# EAGLE design PRG_1_0 (EAGLE 8.3.2)
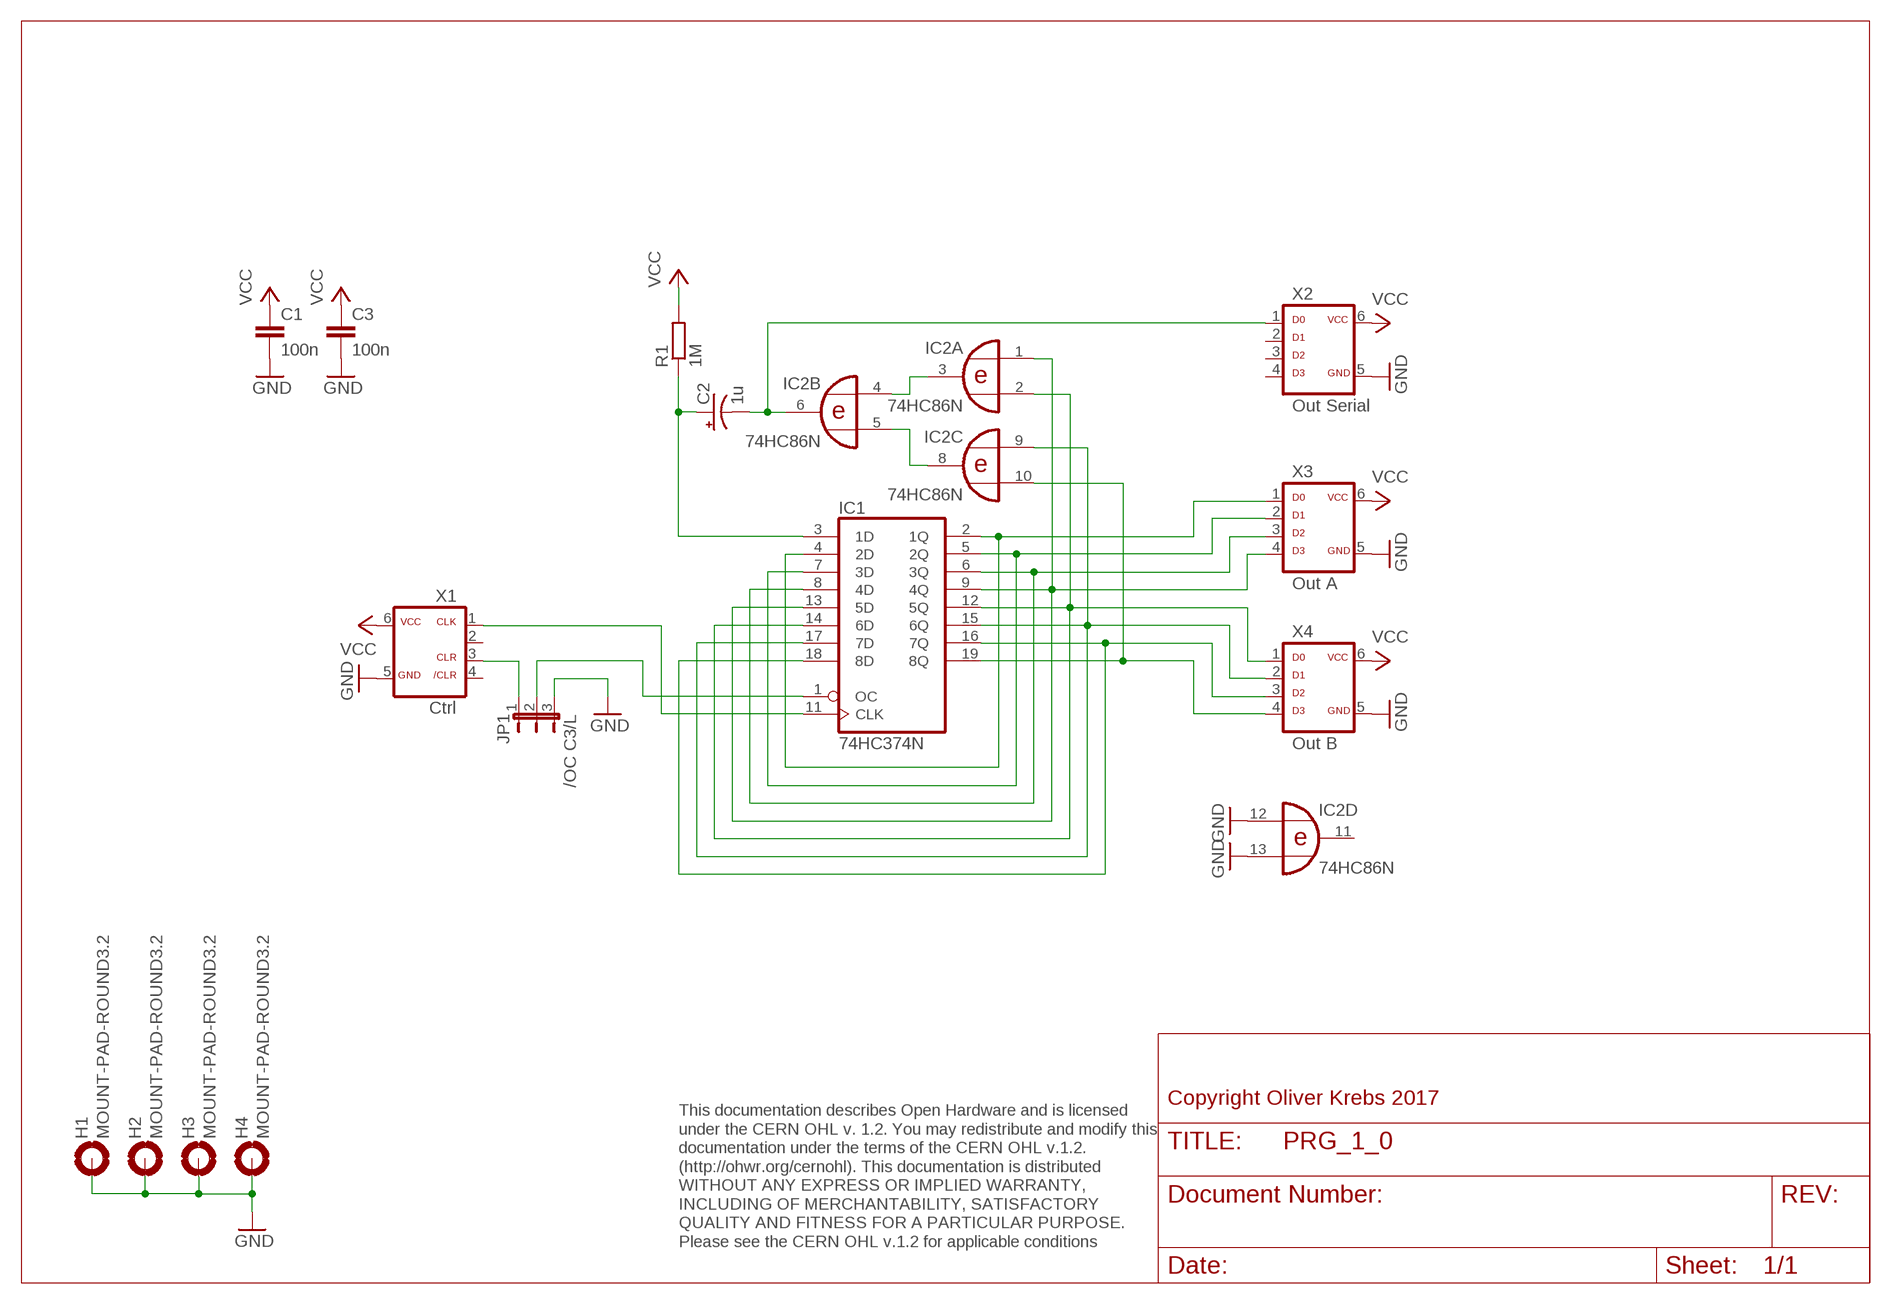
[diagram p0: schematic, sheet 1]

## Parts
C1  100n  C-EU050-025X075  [C050-025X075]
C2  1u  CAP_POLPTH2  [CPOL-RADIAL-10UF-25V]
C3  100n  C-EU050-025X075  [C050-025X075]
H1  MOUNT-PAD-ROUND3.2  [3,2-PAD]
H2  MOUNT-PAD-ROUND3.2  [3,2-PAD]
H3  MOUNT-PAD-ROUND3.2  [3,2-PAD]
H4  MOUNT-PAD-ROUND3.2  [3,2-PAD]
IC1  74HC374N  [DIL20]
IC2  74HC86N  [DIL14]
JP1  /OC C3/L  JP2EJP2-U  [JP2-U]
R1  1M  R-EU_0207/10  [0207/10]
X1  Ctrl  ML6C  [ML-6]
X2  Out Serial  ML6D  [ML-6]
X3  Out A  ML6D  [ML-6]
X4  Out B  ML6D  [ML-6]

## Nets
GND: C1.2 C3.2 H1.B3,2(MOUNT) H2.B3,2(MOUNT) H3.B3,2(MOUNT) H4.B3,2(MOUNT) IC2.12(D:I0) IC2.13(D:I1) JP1.3 X1.5 X2.5 X3.5 X4.5
N$1: IC2.3(A:O) IC2.4(B:I0)
N$2: IC2.5(B:I1) IC2.8(C:O)
N$3: C2.2(-) IC2.6(B:O) X2.1
N$4: C2.1(+) IC1.3(1D) R1.1
N$9: IC1.11(CLK) X1.1
N$10: IC1.1(OC) JP1.2
N$11: IC1.2(1Q) IC1.4(2D) X3.1
N$12: IC1.5(2Q) IC1.7(3D) X3.2
N$13: IC1.6(3Q) IC1.8(4D) X3.3
N$14: IC1.9(4Q) IC1.13(5D) IC2.1(A:I0) X3.4
N$15: IC1.12(5Q) IC1.14(6D) IC2.2(A:I1) X4.1
N$16: IC1.15(6Q) IC1.17(7D) IC2.9(C:I0) X4.2
N$17: IC1.16(7Q) IC1.18(8D) X4.3
N$18: IC1.19(8Q) IC2.10(C:I1) X4.4
N$19: JP1.1 X1.3
VCC: C1.1 C3.1 R1.2 X1.6 X2.6 X3.6 X4.6
Unconnected: IC2.11(D:O) X1.2 X1.4 X2.2 X2.3 X2.4

## Notes on the sheet
- Copyright Oliver Krebs 2017
- This documentation describes Open Hardware and is licensed 
  under the CERN OHL v. 1.2. You may redistribute and modify this 
  documentation under the terms of the CERN OHL v.1.2. 
  (http://ohwr.org/cernohl). This documentation is distributed
  WITHOUT ANY EXPRESS OR IMPLIED WARRANTY, 
  INCLUDING OF MERCHANTABILITY, SATISFACTORY 
  QUALITY AND FITNESS FOR A PARTICULAR PURPOSE. 
  Please see the CERN OHL v.1.2 for applicable conditions

## Power pins joined to a net without a drawn wire
GND: IC1.10(GND) IC2.7(P:GND)
VCC: IC1.20(VCC) IC2.14(P:VCC)

## Library data of the parts
C1 C3 = 01-my_rcl:C-EU: CAPACITOR, European symbol
C2 = SparkFun-Passives:CAP_POL: Capacitor Polarized These are standard SMD and PTH capacitors. Normally 10uF, 47uF, and 100uF in electrolytic and tantalum varieties. Always verify the external diameter of the through hole cap, it varies with capacity, voltage, and manufacturer. The EIA devices should be standard.
H1-H4 = holes:MOUNT-PAD-ROUND: MOUNTING PAD, round
IC1 = 74xx-eu:74*374: Octal D type transparent LATCH, edge triggered
IC2 = 74xx-eu:74*86: Quad 2-input EXCLUSIVE-OR (XOR) gate
JP1 = 01-my-jumper:JP2E: JUMPER
R1 = 01-my_rcl:R-EU_: RESISTOR, European symbol
X1 = 01-my-con:ML6C
X2-X4 = 01-my-con:ML6D

## Board
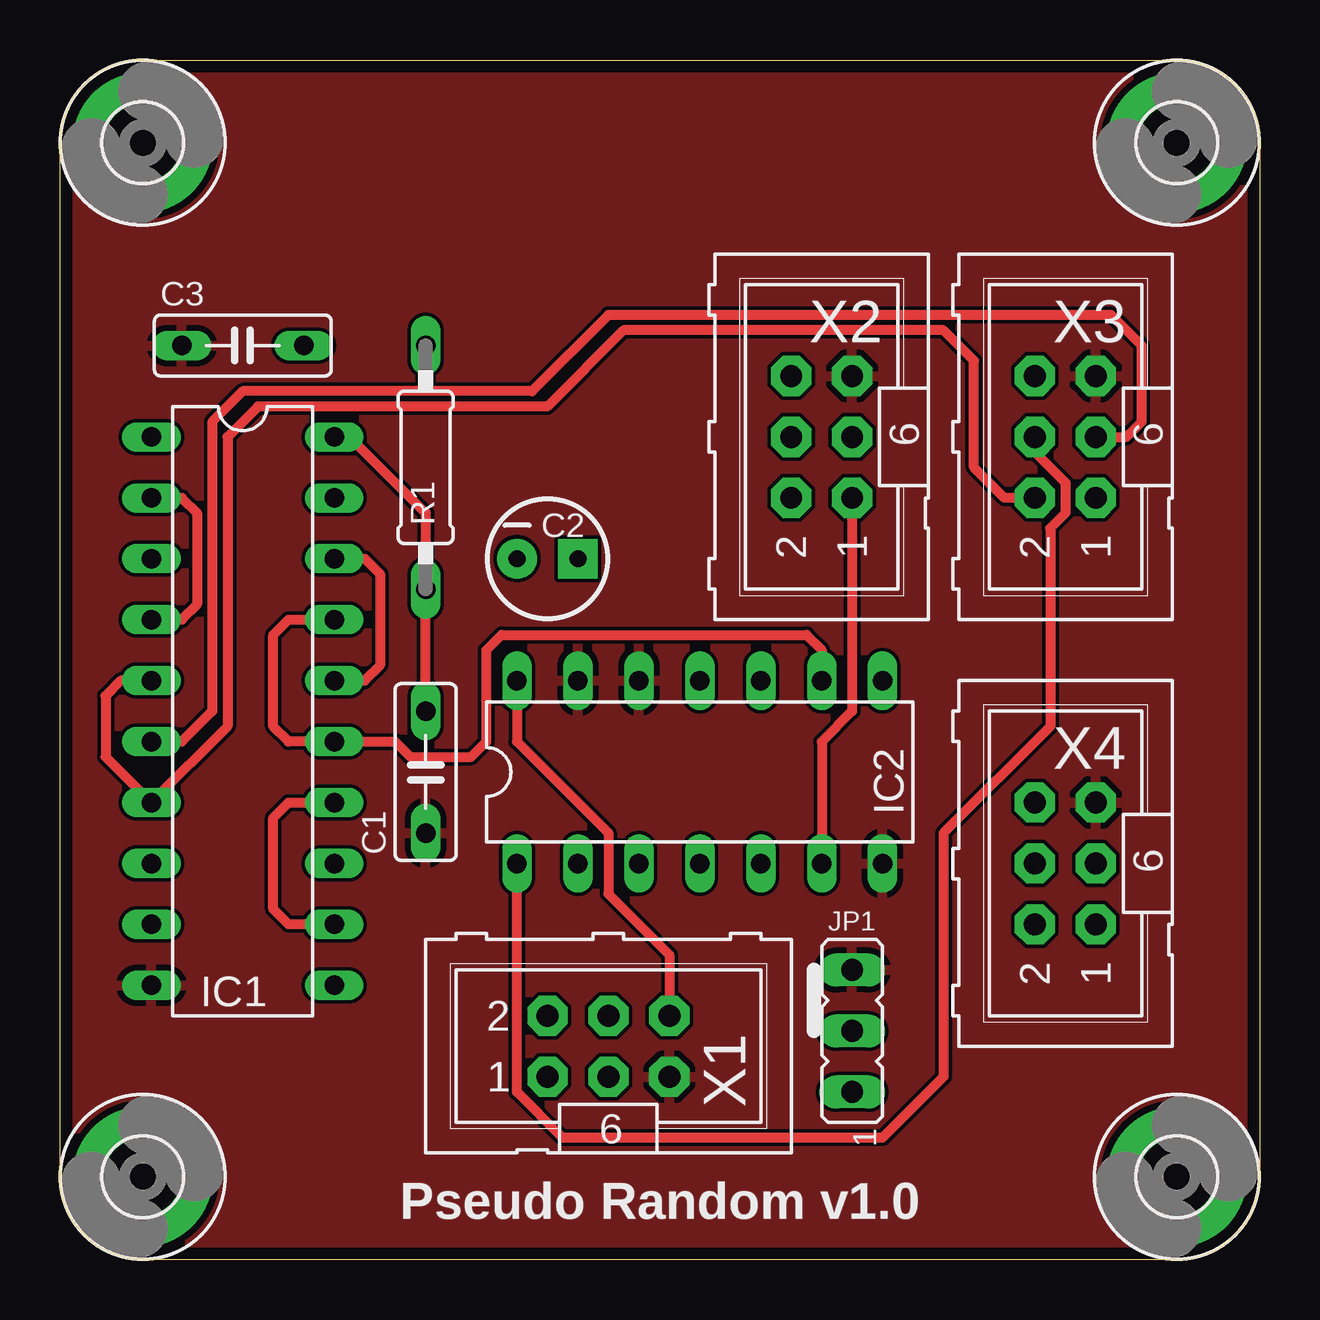
[diagram p1: board, top side]
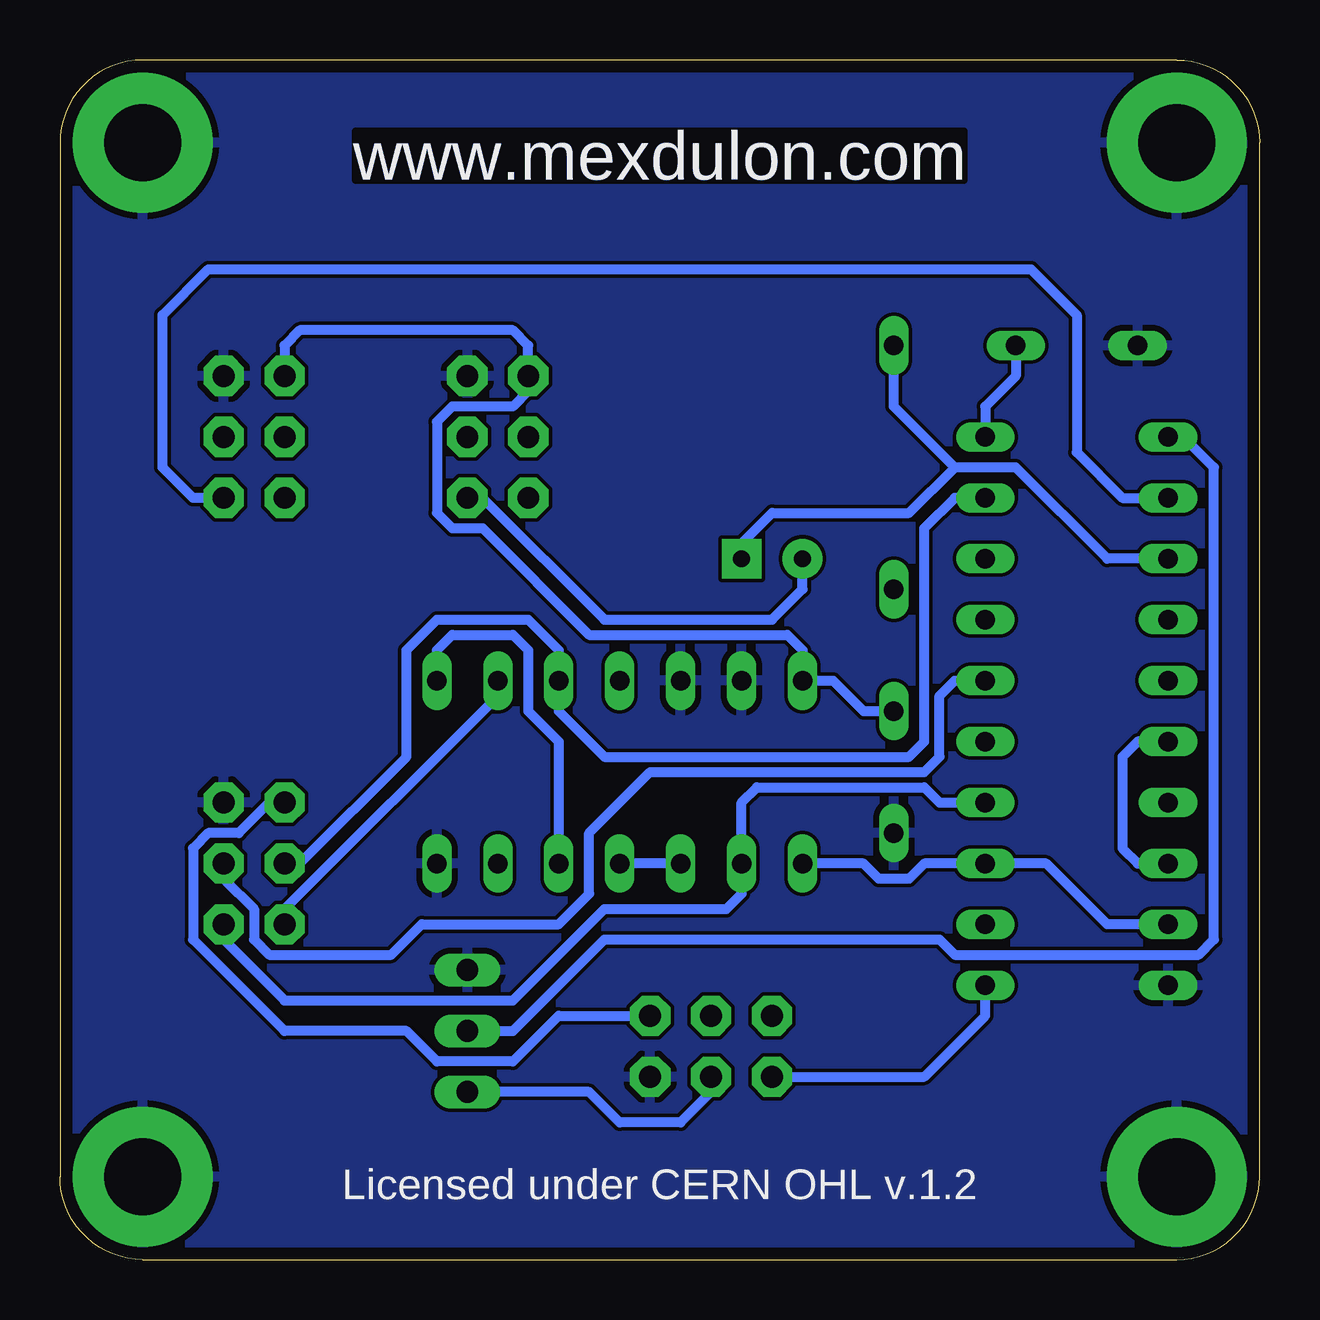
[diagram p2: board, bottom side, seen from below]

Size 50 x 50 mm. Coordinates in mm from the lower left corner, seen from the top.
Outline: 0,3.45 0,46.55 arc-90 3.45,50 46.55,50 arc-90 50,46.55 50,3.45 arc-90 46.55,0 3.45,0 arc-90 0,3.45
Copper layers (1*16): Top 0.035mm / dielectric 1.6mm / Bottom 0.035mm
Design rules "Elecrow_2-layer_PCB_eagle_rule": minimum track width 6mil, minimum drill 12mil, track to track 6mil, track to pad 6mil, pad to pad 6mil, via to via 8mil, smd to smd 0mil, copper to edge 20mil, drill to drill 10mil, minimum pad ring 6mil, minimum via ring 6mil, stop-mask expansion 0mil, vias tented up to drill 100mil, thermal gap 10mil

### Footprints (pad centres in the part's own frame; a part is rotated, then mirrored left to right if it is on the bottom)
C050-025X075 = drill 0.813 long: 1 -2.54,0; 2 2.54,0
CPOL-RADIAL-10UF-25V = drill 0.7 pad 1.651 square: 1 1.27,0 | drill 0.7 pad 1.651: 2 -1.27,0
3,2-PAD = drill 3.2 pad 5.842: B3,2 0,0
DIL20 = drill 0.813 long: 1 -11.43,-3.81; 2 -8.89,-3.81; 3 -6.35,-3.81; 4 -3.81,-3.81; 5 -1.27,-3.81; 6 1.27,-3.81; 7 3.81,-3.81; 8 6.35,-3.81; 9 8.89,-3.81; 10 11.43,-3.81; 11 11.43,3.81; 12 8.89,3.81; 13 6.35,3.81; 14 3.81,3.81; 15 1.27,3.81; 16 -1.27,3.81; 17 -3.81,3.81; 18 -6.35,3.81; 19 -8.89,3.81; 20 -11.43,3.81
DIL14 = drill 0.813 long: 1 -7.62,-3.81; 2 -5.08,-3.81; 3 -2.54,-3.81; 4 0,-3.81; 5 2.54,-3.81; 6 5.08,-3.81; 7 7.62,-3.81; 8 7.62,3.81; 9 5.08,3.81; 10 2.54,3.81; 11 0,3.81; 12 -2.54,3.81; 13 -5.08,3.81; 14 -7.62,3.81
JP2-U = drill 0.914 long: 1 -2.54,0; 2 0,0; 3 2.54,0
0207/10 = drill 0.813 long: 1 -5.08,0; 2 5.08,0
ML-6 = drill 0.914 pad 1.676 octagon: 1 -2.54,-1.27; 2 -2.54,1.27; 3 0,-1.27; 4 0,1.27; 5 2.54,-1.27; 6 2.54,1.27

### Placement (x,y rotation side)
C1  15.24,20.32 270 top
C2  20.32,29.21 0 top
C3  7.62,38.1 180 top
H1  3.45,3.45 0 top
H2  3.45,46.55 0 top
H3  46.55,46.55 0 top
H4  46.55,3.45 0 top
IC1  7.62,22.86 270 top
IC2  26.67,20.32 0 top
JP1  33.02,9.53 90 top
R1  15.24,33.02 270 top
X1  22.86,8.89 0 top
X2  31.75,34.29 90 top
X3  41.91,34.29 90 top
X4  41.91,16.51 90 top

### Tracks (layer width: path | path; a pad name or v marks a point on that pad's centre or on a via)
GND
  pour Bottom: 0,0 50.8,0 50.8,50.8 0,50.8
  pour Top: 0,50.16 50.16,50.16 50.16,0 0,0
N$1
  Bottom 0.406: IC2.3 IC2.4
N$2
  Bottom 0.406: IC2.8 34.29,25.4 33.66,26.04 31.11,26.04 30.48,25.4 30.48,22.86 29.21,21.59 IC2.5
N$3
  Top 0.406: X2.1 33.02,22.86 31.75,21.59 IC2.6
  Bottom 0.406: X2.1 32.38,31.75 27.3,26.67 20.32,26.67 19.05,27.94 C2.2
N$4
  Bottom 0.406: IC1.3 6.35,29.21 10.16,33.02 12.7,33.02 | 12.7,33.02 15.24,35.56 R1.1 | C2.1 21.59,29.84 20.32,31.11 14.61,31.11 12.7,33.02
N$9
  Bottom 0.406: X1.1 13.97,7.62 11.43,10.16 IC1.11
N$10
  Bottom 0.406: JP1.2 31.11,9.53 27.3,13.34 13.34,13.34 12.7,12.7 2.54,12.7 1.91,13.34 1.91,33.02 3.17,34.29 IC1.1
N$11
  Top 0.406: IC1.2 5.08,31.75 5.71,31.11 5.71,27.3 5.08,26.67 IC1.4
  Bottom 0.406: X3.1 44.45,31.75 45.72,33.02 45.72,39.37 43.81,41.27 9.53,41.27 7.62,39.37 7.62,33.66 5.71,31.75 IC1.2
N$12
  Top 0.406: X3.2 39.37,31.75 38.1,33.02 38.1,37.47 36.83,38.73 23.5,38.73 20.32,35.56 8.26,35.56 6.99,34.29 6.99,22.23 IC1.7 1.91,20.95 1.91,23.5 2.54,24.13 IC1.5
N$13
  Top 0.406: X3.3 44.45,34.29 45.09,34.92 45.09,38.1 43.81,39.37 22.86,39.37 19.68,36.2 7.62,36.2 6.35,34.92 6.35,22.86 5.08,21.59 IC1.6
  Bottom 0.406: IC1.6 5.08,21.59 5.71,20.95 5.71,17.14 5.08,16.51 IC1.8
N$14
  Top 0.406: X3.4 40.64,33.66 41.91,32.38 41.91,31.11 41.27,30.48 41.27,22.23 36.83,17.78 36.83,7.62 34.29,5.08 20.95,5.08 19.05,6.99 IC2.1
  Bottom 0.406: IC1.9 6.35,13.97 8.89,16.51 IC1.13 13.97,16.51 14.61,15.88 15.88,15.88 16.51,16.51 IC2.1
N$15
  Top 0.406: IC1.12 9.53,13.97 8.89,14.61 8.89,18.41 9.53,19.05 IC1.14
  Bottom 0.406: IC1.14 13.34,19.05 13.97,19.68 20.95,19.68 21.59,19.05 IC2.2 21.59,15.24 22.23,14.61 27.3,14.61 31.11,10.79 40.64,10.79 43.18,13.34 X4.1
N$16
  Top 0.406: IC1.17 9.53,26.67 8.89,26.04 8.89,22.23 9.53,21.59 IC1.15 13.97,21.59 14.61,20.95 17.14,20.95 17.78,21.59 17.78,25.4 18.41,26.04 31.11,26.04 31.75,25.4 IC2.9
  Bottom 0.406: IC2.9 31.75,23.5 40.64,14.61 X4.2
N$17
  Top 0.406: IC1.18 12.7,29.21 13.34,28.57 13.34,24.77 12.7,24.13 IC1.16
  Bottom 0.406: X4.3 43.18,15.88 41.91,14.61 41.91,13.34 41.27,12.7 36.2,12.7 34.92,13.97 29.21,13.97 27.94,15.24 27.94,17.78 25.4,20.32 13.97,20.32 13.34,20.95 13.34,23.5 12.7,24.13 IC1.16
N$18
  Bottom 0.406: X4.4 40.01,16.51 35.56,20.95 35.56,25.4 34.29,26.67 30.48,26.67 29.21,25.4 IC2.10 29.21,22.86 27.3,20.95 14.61,20.95 13.97,21.59 13.97,30.48 12.7,31.75 IC1.19
N$19
  Bottom 0.406: X1.3 22.86,6.99 24.13,5.71 26.67,5.71 27.94,6.99 JP1.1
VCC
  Top 0.406: IC2.14 19.05,21.59 22.86,17.78 22.86,15.24 25.4,12.7 X1.6 | C1.1 R1.2 15.24,31.11 12.06,34.29 IC1.20
  Bottom 0.406: X4.6 41.27,19.05 42.55,17.78 43.81,17.78 44.45,17.14 44.45,13.34 40.64,9.53 35.56,9.53 34.29,8.26 31.11,8.26 29.21,10.16 X1.6 | C3.1 10.16,36.83 11.43,35.56 IC1.20 | X3.6 40.64,38.1 40.01,38.73 31.11,38.73 30.48,38.1 X2.6 30.48,36.2 31.11,35.56 33.66,35.56 34.29,34.92 34.29,31.11 33.66,30.48 32.38,30.48 27.94,26.04 19.68,26.04 19.05,25.4 IC2.14 17.78,24.13 16.51,22.86 C1.1

### Text on the board
Bottom: www.mexdulon.com
tNames: Pseudo Random v1.0
bNames: www.mexdulon.com | Licensed under CERN OHL v.1.2
200bmp: E:/Bilder/Elektronik/Modulion/Mexdulon/mexdulon_50x50_pcb.bmp